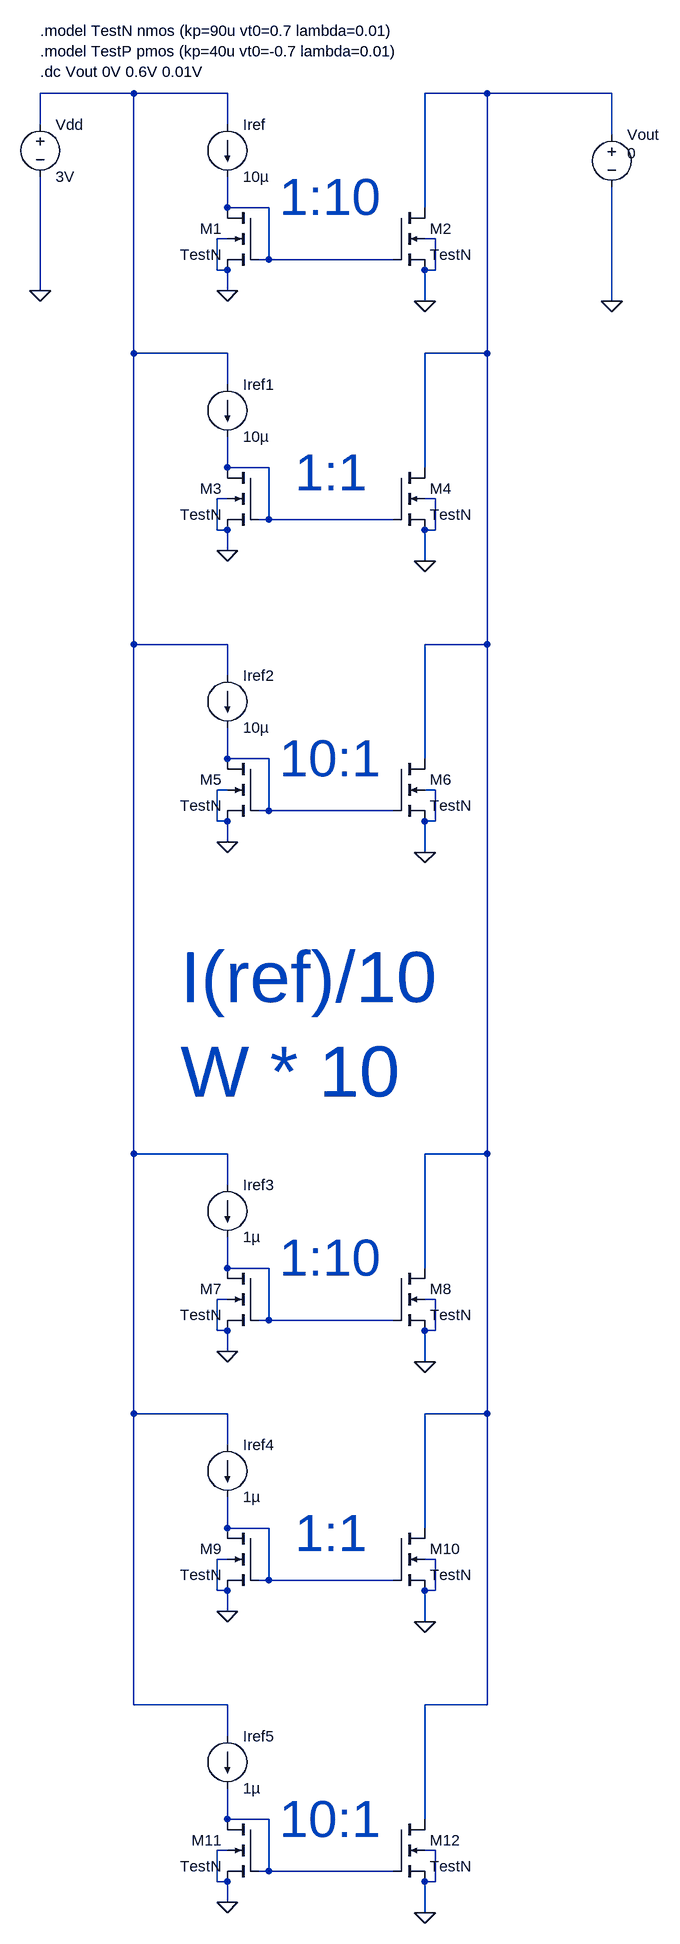
[diagram p0: schematic simple-2.asc]
simple-2.asc, the LTspice schematic file:
Version 4
SHEET 1 924 3748
WIRE -544 896 -688 896
WIRE -400 896 -544 896
WIRE 0 896 -96 896
WIRE 192 896 0 896
WIRE -688 944 -688 896
WIRE -400 944 -400 896
WIRE 192 960 192 896
WIRE -400 1072 -400 1024
WIRE -336 1072 -400 1072
WIRE -96 1072 -96 896
WIRE -400 1120 -416 1120
WIRE -80 1120 -96 1120
WIRE -336 1152 -336 1072
WIRE -336 1152 -352 1152
WIRE -144 1152 -336 1152
WIRE -416 1168 -416 1120
WIRE -400 1168 -416 1168
WIRE -80 1168 -80 1120
WIRE -80 1168 -96 1168
WIRE -688 1200 -688 1024
WIRE -400 1200 -400 1168
WIRE -96 1216 -96 1168
WIRE 192 1216 192 1040
WIRE -544 1296 -544 896
WIRE -400 1296 -544 1296
WIRE 0 1296 0 896
WIRE 0 1296 -96 1296
WIRE -400 1344 -400 1296
WIRE -400 1472 -400 1424
WIRE -336 1472 -400 1472
WIRE -96 1472 -96 1296
WIRE -400 1520 -416 1520
WIRE -80 1520 -96 1520
WIRE -336 1552 -336 1472
WIRE -336 1552 -352 1552
WIRE -144 1552 -336 1552
WIRE -416 1568 -416 1520
WIRE -400 1568 -416 1568
WIRE -80 1568 -80 1520
WIRE -80 1568 -96 1568
WIRE -400 1600 -400 1568
WIRE -96 1616 -96 1568
WIRE -544 1744 -544 1296
WIRE -400 1744 -544 1744
WIRE 0 1744 0 1296
WIRE 0 1744 -96 1744
WIRE -400 1792 -400 1744
WIRE -400 1920 -400 1872
WIRE -336 1920 -400 1920
WIRE -96 1920 -96 1744
WIRE -400 1968 -416 1968
WIRE -80 1968 -96 1968
WIRE -336 2000 -336 1920
WIRE -336 2000 -352 2000
WIRE -144 2000 -336 2000
WIRE -416 2016 -416 1968
WIRE -400 2016 -416 2016
WIRE -80 2016 -80 1968
WIRE -80 2016 -96 2016
WIRE -400 2048 -400 2016
WIRE -96 2064 -96 2016
WIRE -544 2528 -544 1744
WIRE -400 2528 -544 2528
WIRE 0 2528 0 1744
WIRE 0 2528 -96 2528
WIRE -400 2576 -400 2528
WIRE -400 2704 -400 2656
WIRE -336 2704 -400 2704
WIRE -96 2704 -96 2528
WIRE -400 2752 -416 2752
WIRE -80 2752 -96 2752
WIRE -336 2784 -336 2704
WIRE -336 2784 -352 2784
WIRE -144 2784 -336 2784
WIRE -416 2800 -416 2752
WIRE -400 2800 -416 2800
WIRE -80 2800 -80 2752
WIRE -80 2800 -96 2800
WIRE -400 2832 -400 2800
WIRE -96 2848 -96 2800
WIRE -544 2928 -544 2528
WIRE -400 2928 -544 2928
WIRE 0 2928 0 2528
WIRE 0 2928 -96 2928
WIRE -400 2976 -400 2928
WIRE -400 3104 -400 3056
WIRE -336 3104 -400 3104
WIRE -96 3104 -96 2928
WIRE -400 3152 -416 3152
WIRE -80 3152 -96 3152
WIRE -336 3184 -336 3104
WIRE -336 3184 -352 3184
WIRE -144 3184 -336 3184
WIRE -416 3200 -416 3152
WIRE -400 3200 -416 3200
WIRE -80 3200 -80 3152
WIRE -80 3200 -96 3200
WIRE -400 3232 -400 3200
WIRE -96 3248 -96 3200
WIRE -544 3376 -544 2928
WIRE -400 3376 -544 3376
WIRE 0 3376 0 2928
WIRE 0 3376 -96 3376
WIRE -400 3424 -400 3376
WIRE -400 3552 -400 3504
WIRE -336 3552 -400 3552
WIRE -96 3552 -96 3376
WIRE -400 3600 -416 3600
WIRE -80 3600 -96 3600
WIRE -336 3632 -336 3552
WIRE -336 3632 -352 3632
WIRE -144 3632 -336 3632
WIRE -416 3648 -416 3600
WIRE -400 3648 -416 3648
WIRE -80 3648 -80 3600
WIRE -80 3648 -96 3648
WIRE -400 3680 -400 3648
WIRE -96 3696 -96 3648
FLAG -400 1200 0
FLAG -688 1200 0
FLAG -96 1216 0
FLAG 192 1216 0
FLAG -400 1600 0
FLAG -96 1616 0
FLAG -400 2048 0
FLAG -96 2064 0
FLAG -400 2832 0
FLAG -96 2848 0
FLAG -400 3232 0
FLAG -96 3248 0
FLAG -400 3680 0
FLAG -96 3696 0
SYMBOL voltage 192 944 R0
WINDOW 3 24 44 Left 2
WINDOW 123 0 0 Left 2
WINDOW 39 0 0 Left 2
SYMATTR Value 0
SYMATTR InstName Vout
SYMBOL current -400 944 R0
WINDOW 123 0 0 Left 2
WINDOW 39 0 0 Left 2
SYMATTR InstName Iref
SYMATTR Value 10µ
SYMBOL voltage -688 928 R0
SYMATTR InstName Vdd
SYMATTR Value 3V
SYMBOL nmos4 -352 1072 M0
SYMATTR InstName M1
SYMATTR Value TestN
SYMATTR Value2 l=10u w=10u
SYMBOL nmos4 -144 1072 R0
SYMATTR InstName M2
SYMATTR Value TestN
SYMATTR Value2 l=10u w=100u
SYMBOL current -400 1344 R0
WINDOW 123 0 0 Left 2
WINDOW 39 0 0 Left 2
SYMATTR InstName Iref1
SYMATTR Value 10µ
SYMBOL nmos4 -352 1472 M0
SYMATTR InstName M3
SYMATTR Value TestN
SYMATTR Value2 l=10u w=10u
SYMBOL nmos4 -144 1472 R0
SYMATTR InstName M4
SYMATTR Value TestN
SYMATTR Value2 l=10u w=10u
SYMBOL current -400 1792 R0
WINDOW 123 0 0 Left 2
WINDOW 39 0 0 Left 2
SYMATTR InstName Iref2
SYMATTR Value 10µ
SYMBOL nmos4 -352 1920 M0
SYMATTR InstName M5
SYMATTR Value TestN
SYMATTR Value2 l=10u w=100u
SYMBOL nmos4 -144 1920 R0
SYMATTR InstName M6
SYMATTR Value TestN
SYMATTR Value2 l=10u w=10u
SYMBOL current -400 2576 R0
WINDOW 123 0 0 Left 2
WINDOW 39 0 0 Left 2
SYMATTR InstName Iref3
SYMATTR Value 1µ
SYMBOL nmos4 -352 2704 M0
SYMATTR InstName M7
SYMATTR Value TestN
SYMATTR Value2 l=10u w=10u
SYMBOL nmos4 -144 2704 R0
SYMATTR InstName M8
SYMATTR Value TestN
SYMATTR Value2 l=10u w=1000u
SYMBOL current -400 2976 R0
WINDOW 123 0 0 Left 2
WINDOW 39 0 0 Left 2
SYMATTR InstName Iref4
SYMATTR Value 1µ
SYMBOL nmos4 -352 3104 M0
SYMATTR InstName M9
SYMATTR Value TestN
SYMATTR Value2 l=10u w=10u
SYMBOL nmos4 -144 3104 R0
SYMATTR InstName M10
SYMATTR Value TestN
SYMATTR Value2 l=10u w=100u
SYMBOL current -400 3424 R0
WINDOW 123 0 0 Left 2
WINDOW 39 0 0 Left 2
SYMATTR InstName Iref5
SYMATTR Value 1µ
SYMBOL nmos4 -352 3552 M0
SYMATTR InstName M11
SYMATTR Value TestN
SYMATTR Value2 l=10u w=100u
SYMBOL nmos4 -144 3552 R0
SYMATTR InstName M12
SYMATTR Value TestN
SYMATTR Value2 l=10u w=100u
TEXT -688 800 Left 2 !.model TestN nmos (kp=90u vt0=0.7 lambda=0.01)\n.model TestP pmos (kp=40u vt0=-0.7 lambda=0.01)\n.dc Vout 0V 0.6V 0.01V
TEXT -320 1056 Left 6 ;1:10
TEXT -296 1480 Left 6 ;1:1
TEXT -320 1920 Left 6 ;10:1
TEXT -320 2688 Left 6 ;1:10
TEXT -296 3112 Left 6 ;1:1
TEXT -320 3552 Left 6 ;10:1
TEXT -472 2256 Left 7 ;I(ref)/10\nW * 10

The netlist it stands for:
* simple-2.asc
Vout N002 0 0
Iref N001 N003 10µ
Vdd N001 0 3V
M1 N003 N003 0 0 TestN l=10u w=10u
M2 N002 N003 0 0 TestN l=10u w=100u
Iref1 N001 N004 10µ
M3 N004 N004 0 0 TestN l=10u w=10u
M4 N002 N004 0 0 TestN l=10u w=10u
Iref2 N001 N005 10µ
M5 N005 N005 0 0 TestN l=10u w=100u
M6 N002 N005 0 0 TestN l=10u w=10u
Iref3 N001 N006 1µ
M7 N006 N006 0 0 TestN l=10u w=10u
M8 N002 N006 0 0 TestN l=10u w=1000u
Iref4 N001 N007 1µ
M9 N007 N007 0 0 TestN l=10u w=10u
M10 N002 N007 0 0 TestN l=10u w=100u
Iref5 N001 N008 1µ
M11 N008 N008 0 0 TestN l=10u w=100u
M12 N002 N008 0 0 TestN l=10u w=100u
.model NMOS NMOS
.model PMOS PMOS
.lib standard.mos
.model TestN nmos (kp=90u vt0=0.7 lambda=0.01)
.model TestP pmos (kp=40u vt0=-0.7 lambda=0.01)
.dc Vout 0V 0.6V 0.01V
* 1:10
* 1:1
* 10:1
* 1:10
* 1:1
* 10:1
* I(ref)/10
* W * 10
.backanno
.end